# Altium schematic sheet drv.SchDoc
size A4
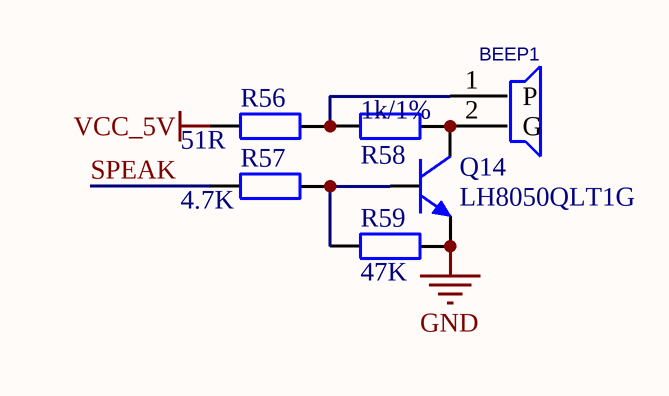
[diagram p0: drv.SchDoc]

## Parts
BEEP1  BEEP-9.5X5.5  [BEEP-9.5X5.5]  (value not drawn)
Q14  LH8050QLT1G  [SOT-23]
R56  51R  [0603R]
R57  4.7K  [0603R]
R58  1k/1%  [0603R]
R59  47K  [0603R]

## Nets
GND: Q14.2(E) R59.2
VCC_5V: R56.2
SPEAK: R57.1
NetBEEP1_1: BEEP1.1(P) R56.1 R58.2
NetBEEP1_2: BEEP1.2(G) Q14.3(C) R58.1
NetQ14_1: Q14.1(B) R57.2 R59.1

## Library data of the parts
Q14 = NPN-1: NPN
R56-R59 = RES0: 贴片电阻 5%
BEEP1 = BEEP-9.5X5.5: PCB DECAL: BEEP-9.5X5.5